# Altium schematic sheet Analiser.SchDoc
size A4
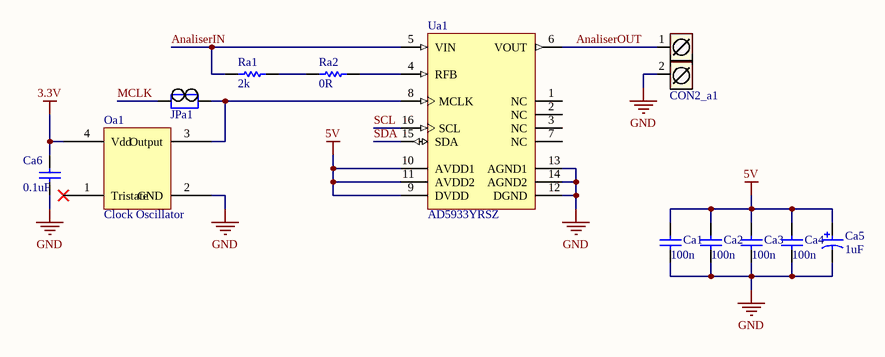
[diagram p0: Analiser.SchDoc]

## Parts
Ca1  100n  [CAPC0603(1608)100_L]
Ca2  100n  [CAPC0603(1608)100_L]
Ca3  100n  [CAPC0603(1608)100_L]
Ca4  100n  [CAPC0603(1608)100_L]
Ca5  1uF  [CAPMP3217X18-T_V]
Ca6  0.1uF  [CAPC0603(1608)100_L]
CON2_a1  ARK2  [ARK2]  (value not drawn)
JPa1  Jumper  [HDR1X2 - JP]  (value not drawn)
Oa1  Clock Oscillator  [Oscillator SMD]
Ra1  2k  [RESC0603(1608)_L]
Ra2  0R  [RESC0603(1608)_L]
Ua1  AD5933YRSZ  [ADI-RS-16_L]

## Nets
3.3V: Ca6.2 Oa1.4(Vdd)
5V: Ca1.2 Ca2.2 Ca3.2 Ca4.2 Ca5.1 Ua1.9(DVDD) Ua1.10(AVDD1) Ua1.11(AVDD2)
GND: Ca1.1 Ca2.1 Ca3.1 Ca4.1 Ca5.2 Ca6.1 CON2_a1.2 Oa1.2(GND) Ua1.12(DGND) Ua1.13(AGND1) Ua1.14(AGND2)
AnaliserIN: Ra1.1 Ua1.5(VIN)
AnaliserOUT: CON2_a1.1 Ua1.6(VOUT)
MCLK: JPa1.1
SCL: Ua1.16(SCL)
SDA: Ua1.15(SDA)
NetJPa1_2: JPa1.2 Oa1.3(Output) Ua1.8(MCLK)
NetRa1_2: Ra1.2 Ra2.1
NetRa2_2: Ra2.2 Ua1.4(RFB)

Not connected (* = marked no-connect by the designer): Oa1 1(Tristate)*; Ua1 1(NC) 2(NC) 3(NC) 7(NC)

## Library data of the parts
Ca1-Ca4 Ca6 = CMP-1590-00005-1: 0603 (1608 Metric) Chip Capacitor; Case-Metric: 1608; Case-EIA: 0603; PackageReference: CAPC0603(1608)100
Ca5 = CMP-1661-00003-1: Standard Tantalum, 1 uF, +/- 10%, 35 V, -55 to 125 degC, 2-Pin SMD (1206), RoHS, Tape and Reel; Current Rating: 200 mA; Voltage Rating (DC): 30 V; REACH SVHC: No SVHC; ComponentLink2URL: http://datasheets.avx.com/TAJ.pdf; Pins: 3; PackageReference: CAPMP3217X18-T; Width: 4 mm; ComponentLink3Description: Package Specification; Length: 11.6 mm; PackageDescription: 2-Pin Surface Mount Device, Body 3.2 x 1.65 mm; ComponentLink2Description: Datasheet; Max Operating Temperature: 70 degC; Contact Material: Copper; Contact Finish: Silver; DatasheetVersion: Feb-16; Contact Plating: Silver; Package Quantity: 1000; Height: 7.4 mm; Min Operating Temperature: -20 degC; Packaging: Bulk; RoHSCompliant: true; ComponentLink1URL: http://www.avx.com/; Mount: Through Hole; ComponentLink1Description: Manufacturer URL; ComponentLink3URL: http://www.avx.com/download/software/literature/AVX-Footprint-Library.pdf
CON2_a1 = ARK2: Złącze śrubowe 2 piny
JPa1 = Jumper_2: Jumper, 2-Pin
Oa1 = Clock Oscillator: 1.8MHz Clock Source SMD
Ra1 Ra2 = CMP-1591-00001-1: 0603 (1608 Metric) Chip Resistor; Case-Metric: 1608; Case-EIA: 0603; PackageReference: RESC0603(1608)
Ua1 = CMP-0293-00046-1: 1 MSPS, 12-Bit Impedance Converter, Network Analyzer, Serial, RS-16, 77 Tube, Pb-Free; Tuning Word Width (bits): 27bit; I Supply total (max): 15mA; Master fclk: 16.776MHz; Resolution (Bits): 12bit; PackageVersion: 3/17/2005; I/O Interface: Serial; ComponentLink2URL: http://www.analog.com/static/imported-files/data_sheets/AD5933.pdf; PackageReference: RS-16; ComponentLink2Description: Datasheet; ComponentLink1URL: www.analog.com; Code_JEDEC: MO-150-AC; PackageDescription: 16-Lead Shrink Small Outline Package [SSOP]; ComponentLink1Description: Manufacturer URL; ComponentLink3URL: http://www.analog.com/static/imported-files/packages/31572257652246RS_16.pdf; ComponentLink3Description: Package Specification; DatasheetVersion: Rev. D